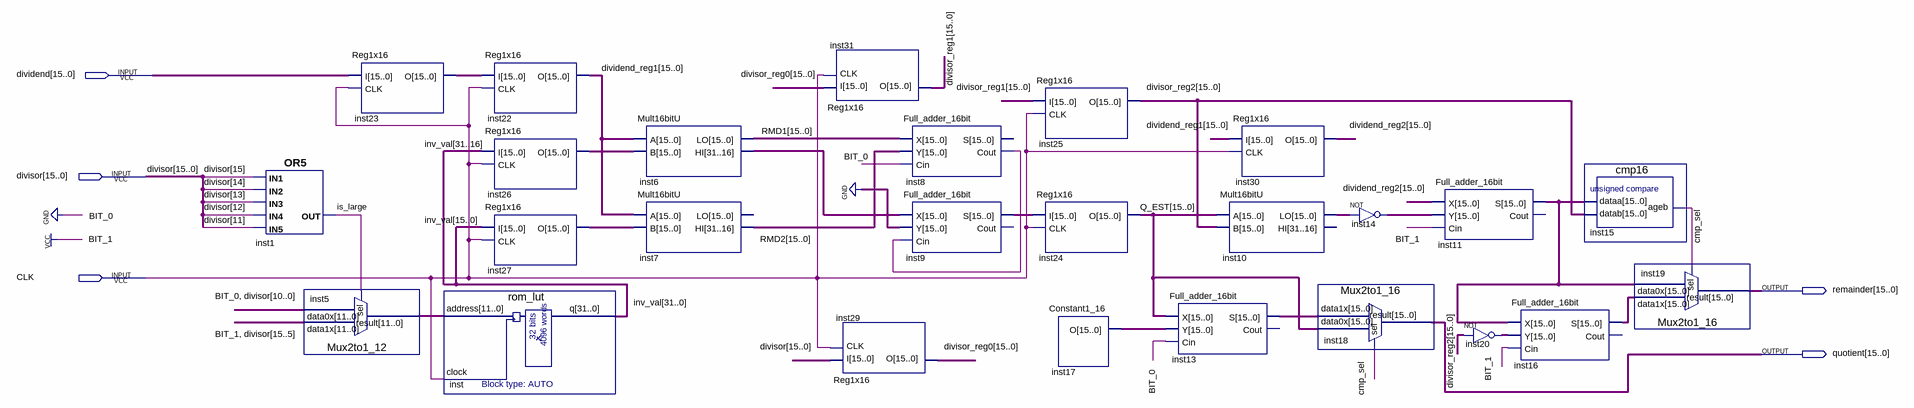
[diagram p0: schematic sheet]
// Quartus schematic Div16.bdf as structural Verilog: 26 symbols, 5 pins
module Div16 (
  input  [15:0] dividend,
  input  [15:0] divisor,
  input  CLK,
  output [15:0] remainder,
  output [15:0] quotient
);

  wire cmp_sel, inst8_cout, is_large;
  wire [11:0] inst5_result;
  wire [15:0] dividend_reg1, dividend_reg2, divisor_reg0, divisor_reg1, divisor_reg2, inst6_hi, inst9_s,
       inst10_lo, inst11_s, inst13_s, inst14_out, inst16_s, inst17_o, inst20_out, inst23_o, inst26_o,
       inst27_o, Q_EST, RMD1, RMD2;
  wire [31:0] inv_val;

  or inst1 (is_large, divisor[15], divisor[14], divisor[13], divisor[12], divisor[11]);
  Mux2to1_12 inst5 (
    .data1x({1'b1, divisor[15:5]}), .data0x({1'b0, divisor[10:0]}), .sel(is_large), .result(inst5_result));
  Reg1x16 inst23 (.I(dividend), .CLK(CLK), .O(inst23_o));
  rom_lut inst (.address(inst5_result), .clock(CLK), .q(inv_val));
  Reg1x16 inst22 (.I(inst23_o), .CLK(CLK), .O(dividend_reg1));
  Reg1x16 inst26 (.I(inv_val[31:16]), .CLK(CLK), .O(inst26_o));
  Reg1x16 inst27 (.I(inv_val[15:0]), .CLK(CLK), .O(inst27_o));
  Mult16bitU inst6 (.A(dividend_reg1), .B(inst26_o), .HI(inst6_hi), .LO(RMD1));
  Mult16bitU inst7 (.A(dividend_reg1), .B(inst27_o), .HI(RMD2));  // open: LO
  Reg1x16 inst31 (.I(divisor_reg0), .CLK(CLK), .O(divisor_reg1));
  Reg1x16 inst29 (.I(divisor), .CLK(CLK), .O(divisor_reg0));
  Full_adder_16bit inst8 (.X(RMD1), .Y(RMD2), .Cin(1'b0), .Cout(inst8_cout));  // open: S
  Full_adder_16bit inst9 (.X(inst6_hi), .Y({16{1'b0}}), .Cin(inst8_cout), .S(inst9_s));  // open: Cout
  Reg1x16 inst25 (.I(divisor_reg1), .CLK(CLK), .O(divisor_reg2));
  Reg1x16 inst24 (.I(inst9_s), .CLK(CLK), .O(Q_EST));
  Constant1_16 inst17 (.O(inst17_o));
  Full_adder_16bit inst13 (.X(Q_EST), .Y(inst17_o), .Cin(1'b0), .S(inst13_s));  // open: Cout
  Reg1x16 inst30 (.I(dividend_reg1), .CLK(CLK), .O(dividend_reg2));
  Mult16bitU inst10 (.A(Q_EST), .B(divisor_reg2), .LO(inst10_lo));  // open: HI
  Mux2to1_16 inst18 (.data1x(inst13_s), .data0x(Q_EST), .sel(cmp_sel), .result(quotient));
  assign inst14_out = ~inst10_lo;  // NOT inst14, 16 bits wide
  Full_adder_16bit inst11 (.X(dividend_reg2), .Y(inst14_out), .Cin(1'b1), .S(inst11_s));  // open: Cout
  assign inst20_out = ~divisor_reg2;  // NOT inst20, 16 bits wide
  Full_adder_16bit inst16 (.X(inst11_s), .Y(inst20_out), .Cin(1'b1), .S(inst16_s));  // open: Cout
  cmp16 inst15 (.dataa(inst11_s), .datab(divisor_reg2), .ageb(cmp_sel));
  Mux2to1_16 inst19 (.data1x(inst16_s), .data0x(inst11_s), .sel(cmp_sel), .result(remainder));
endmodule
